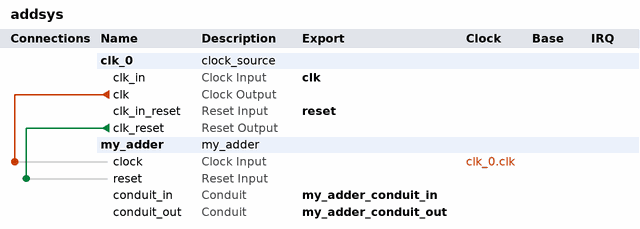
[diagram p0: system contents]
# Platform Designer (Qsys) system addsys, Cyclone V 5CSXFC6D6F31C6
# Parameters at their usual value, and those the tool derives, are not listed.
package require -exact qsys 16.0
create_system addsys
set_project_property DEVICE_FAMILY {Cyclone V}
set_project_property DEVICE 5CSXFC6D6F31C6

add_instance clk_0 clock_source 16.0
set_instance_parameter_value clk_0 clockFrequency 50000000

add_instance my_adder my_adder 1.0
set_instance_parameter_value my_adder WIDTH 8

# connections
add_connection clk_0.clk my_adder.clock clock
add_connection clk_0.clk_reset my_adder.reset reset

# exported interfaces
add_interface clk clock sink
set_interface_property clk EXPORT_OF clk_0.clk_in
add_interface my_adder_conduit_in conduit end
set_interface_property my_adder_conduit_in EXPORT_OF my_adder.conduit_in
add_interface my_adder_conduit_out conduit end
set_interface_property my_adder_conduit_out EXPORT_OF my_adder.conduit_out
add_interface reset reset sink
set_interface_property reset EXPORT_OF clk_0.clk_in_reset

set_interconnect_requirement {$system} qsys_mm.clockCrossingAdapter HANDSHAKE
set_interconnect_requirement {$system} qsys_mm.enableEccProtection FALSE
set_interconnect_requirement {$system} qsys_mm.insertDefaultSlave FALSE
set_interconnect_requirement {$system} qsys_mm.maxAdditionalLatency 1

save_system addsys.qsys
